# EAGLE design Impedance_7x7 (EAGLE 9.6.2)
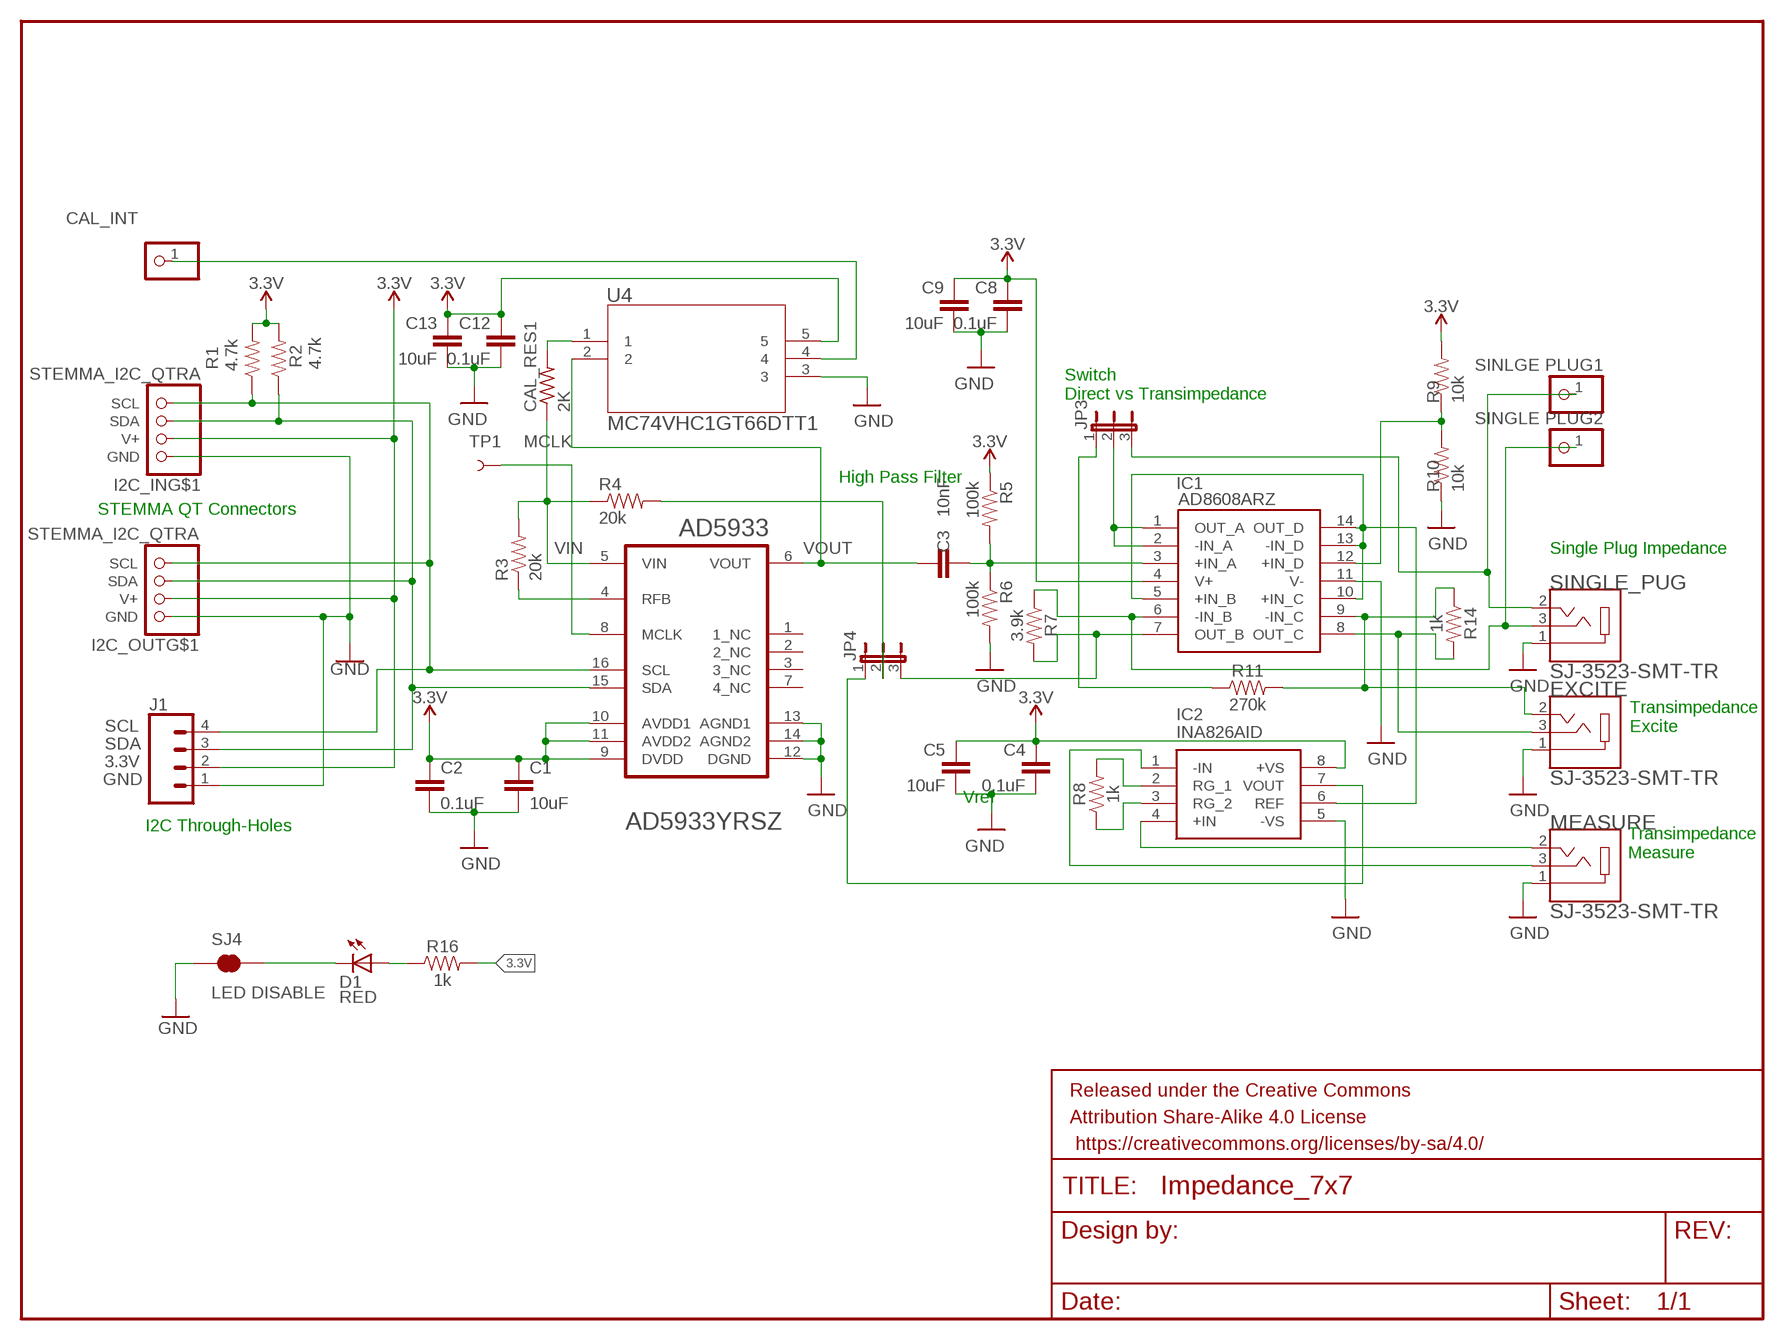
[diagram p0: schematic, sheet 1]

## Parts
AD5933  ANALOG_DEVICES_AD5933YRSZANALOG_DEVICES_AD5933YRSZ_0_0  [ANALOG_DEVICES_AD5933YRSZ_0]
C1  10uF  C-EUC0603  [C0603]
C2  0.1uF  C-EUC0603  [C0603]
C3  10nF  0.1UF-0603-25V-(+80/-20%)  [0603]
C4  0.1uF  C-EUC0603  [C0603]
C5  10uF  C-EUC0603  [C0603]
C8  0.1uF  C-EUC0603  [C0603]
C9  10uF  C-EUC0603  [C0603]
C12  0.1uF  C-EUC0603  [C0603]
C13  10uF  C-EUC0603  [C0603]
CAL_INT  PINHD-1X1  [1X01]
CAL_RES1  2K  R-US_R0603  [R0603]
D1  RED  LED-RED0603  [LED-0603]
EXCITE  SJ-3523-SMT-TR  [CUI_SJ-3523-SMT-TR]
FRAME1  FRAME-LETTERNO_PACKAGE  [DUMMY]
I2C_IN  STEMMA_I2C_QTRA  [JST_SH4_RA]
I2C_OUT  STEMMA_I2C_QTRA  [JST_SH4_RA]
IC1  AD8608ARZ  [SOIC127P600X175-14N]
IC2  INA826AID  [SOIC127P600X175-8N]
J1  CONN_04  [1X04]
JP3  JP2E  [JP2]
JP4  JP2E  [JP2]
MEASURE  SJ-3523-SMT-TR  [CUI_SJ-3523-SMT-TR]
R1  4.7k  4.7KOHM-0603-1/10W-1%  [0603]
R2  4.7k  4.7KOHM-0603-1/10W-1%  [0603]
R3  20k  20KOHM-0603-1/10W-1%  [0603]
R4  20k  20KOHM-0603-1/10W-1%  [0603]
R5  100k  47KOHM-0603-1/10W-1%  [0603]
R6  100k  47KOHM-0603-1/10W-1%  [0603]
R7  3.9k  3.9KOHM-0603-1/10W-1%  [0603]
R8  1k  5.6KOHM-0603-1/10W-1%  [0603]
R9  10k  47KOHM-0603-1/10W-1%  [0603]
R10  10k  47KOHM-0603-1/10W-1%  [0603]
R11  270k  1KOHM-0603-1/10W-1%  [0603]
R14  1k  1KOHM-0603-1/10W-1%  [0603]
R16  1k  1KOHM-0603-1/10W-1%  [0603]
SINGLE_PLUG1  SINLGE PLUG1  PINHD-1X1  [1X01]
SINGLE_PLUG2  SINGLE PLUG2  PINHD-1X1  [1X01]
SINGLE_PUG  SJ-3523-SMT-TR  [CUI_SJ-3523-SMT-TR]
SJ4  LED DISABLE  JUMPER-SMT_2_NC_TRACE_NO-SILK  [SMT-JUMPER_2_NC_TRACE_NO-SILK]
TP1  TEST-POINT3X5  [PAD.03X.05]
U4  MC74VHC1GT66DTT1  [TSOP5_1P65X3P15_ONS]

## Nets
3.3V: AD5933.9(DVDD) AD5933.10(AVDD1) AD5933.11(AVDD2) C1.1 C2.1 C4.1 C5.1 C8.1 C9.1 C12.1 C13.1 I2C_IN.2(V+) I2C_OUT.2(V+) IC1.4(V+) IC2.8(+VS) J1.2 R1.2 R2.2 R5.1 R9.2 R16.2 U4.5
GND: AD5933.12(DGND) AD5933.13(AGND1) AD5933.14(AGND2) C1.2 C2.2 C4.2 C5.2 C8.2 C9.2 C12.2 C13.2 EXCITE.1 I2C_IN.1(GND) I2C_OUT.1(GND) IC1.11(V-) IC2.5(-VS) J1.1 MEASURE.1 R6.2 R10.1 SINGLE_PUG.1 SJ4.1 U4.3
MCLK: AD5933.8(MCLK) TP1.P$1
N$1: IC1.6(-IN_B) R7.1 SINGLE_PLUG2.1 SINGLE_PUG.3
N$2: CAL_INT.1 U4.4
N$3: IC1.7(OUT_B) JP4.3 R7.2
N$4: JP4.2 R4.2
N$5: AD5933.4(RFB) R3.1
N$6: C3.2 IC1.3(+IN_A) R5.2 R6.1
N$7: JP3.3 SINGLE_PLUG1.1 SINGLE_PUG.2
N$8: JP3.1 R11.1
N$9: IC1.1(OUT_A) IC1.2(-IN_A) JP3.2
N$13: IC2.7(VOUT) JP4.1
N$14: IC1.12(+IN_D) R9.1 R10.2
N$18: IC1.5(+IN_B) IC1.10(+IN_C) IC1.13(-IN_D) IC1.14(OUT_D) IC2.6(REF)
N$19: EXCITE.2 IC1.9(-IN_C) R11.2 R14.1
N$20: IC2.4(+IN) MEASURE.2
N$21: IC2.1(-IN) MEASURE.3
N$22: IC2.2(RG_1) R8.2
N$23: IC2.3(RG_2) R8.1
N$24: CAL_RES1.2 U4.1
N$25: EXCITE.3 IC1.8(OUT_C) R14.2
N$26: D1.A R16.1
N$28: D1.C SJ4.2
SCL: AD5933.16(SCL) I2C_IN.4(SCL) I2C_OUT.4(SCL) J1.4 R1.1
SDA: AD5933.15(SDA) I2C_IN.3(SDA) I2C_OUT.3(SDA) J1.3 R2.1
VIN: AD5933.5(VIN) CAL_RES1.1 R3.2 R4.1
VOUT: AD5933.6(VOUT) C3.1 U4.2
Unconnected: AD5933.1(1_NC) AD5933.2(2_NC) AD5933.3(3_NC) AD5933.7(4_NC) I2C_IN.MT1(MT) I2C_IN.MT2(MT) I2C_OUT.MT1(MT) I2C_OUT.MT2(MT)

## Notes on the sheet
- Switch 
  Direct vs Transimpedance
- High Pass Filter
- STEMMA QT Connectors
- Single Plug Impedance
- Transimpedance
  Excite
- Vref
- I2C Through-Holes
- Transimpedance
  Measure

## Library data of the parts
AD5933 = Analog Devices - AD5933YRSZ:ANALOG_DEVICES_AD5933YRSZ: ADI-AD5933-RS-16; CIIVA_IDS: 19299999; CODE__JEDEC: MO-150-AC; COMPONENT_LINK_1_DESCRIPTION: Manufacturer URL; COMPONENT_LINK_1_URL: www.analog.com; COMPONENT_LINK_3_DESCRIPTION: Package Specification; COMPONENT_LINK_3_URL: http://www.analog.com/static/imported-files/packages/31572257652246RS_16.pdf; DATASHEET: http://www.analog.com/static/imported-files/data_sheets/AD5933.pdf; DATASHEET_VERSION: Rev. D; FOOTPRINT_VARIANT_NAME_0: Level C; FOOTPRINT_VARIANT_NAME_1: Level B; FOOTPRINT_VARIANT_NAME_2: Level A; IMPORTED: yes; IMPORTED_FROM: vault; IMPORT_TS: 1521848033; IO_INTERFACE: Serial; I_SUPPLY_TOTAL_MAX: 15mA; MASTER_FCLK: 16.776MHz; MF: Analog Devices; MPN: AD5933YRSZ; PACKAGE: RS-16; PACKAGE_DESCRIPTION: 16-Lead Shrink Small Outline Package [SSOP]; PACKAGE_VERSION: 3/17/2005; PIN_0_0_15_INSIDE_EDGE: clock; PIN_0_0_7_INSIDE_EDGE: clock; PREFIX: U; RELEASE_DATE: 1333437714; RESOLUTION_BITS: 12bit; TUNING_WORD_WIDTH_BITS: 27bit; VAULT_GUID: 12E548FF-7E75-4596-9B3A-06B167E4919E; VAULT_REVISION: 0B288880-7FBC-46A2-8187-17CED40A7223
C1 C2 C4 C5 C8 C9 C12 C13 = rcl:C-EU: CAPACITOR, European symbol; SPICEPREFIX: C
C3 = SparkFun-Capacitors:0.1UF: 0.1µF ceramic capacitors A capacitor is a passive two-terminal electrical component used to store electrical energy temporarily in an electric field.; PROD_ID: CAP-00810; VALUE: 0.1uF
CAL_INT SINGLE_PLUG1 SINGLE_PLUG2 = pinhead:PINHD-1X1: PIN HEADER
CAL_RES1 = rcl:R-US_: RESISTOR, American symbol; SPICEPREFIX: R
D1 = SparkFun-LED:LED-RED: Assorted Red LEDs LilyPad 1206- DIO-09912 1206- DIO-00809 0603- DIO-00819; PROD_ID: DIO-00819
EXCITE MEASURE SINGLE_PUG = SJ-3523-SMT-TR:SJ-3523-SMT-TR: Audio Jack Connector 3.5 mm Low Profile Surface Mount Stereo Jack, 3 Pin Right-Angle Check availability <https://pricing.snapeda.com/parts/SJ-3523-SMT-TR/CUI%20Devices/view-part?ref=eda>; AVAILABILITY: In Stock; CUI_PURCHASE_URL: https://www.cuidevices.com/product/interconnect/connectors/audio-connectors/jacks/sj-352x-smt-series?utm_source=snapeda.com&utm_medium=referral&utm_campaign=snapedaBOM; DESCRIPTION: 3.5 mm, Stereo, Right Angle, Surface Mount (SMT), 3 Conductors, 0~1 Internal Switches, Audio Jack Connector; MF: CUI Devices; MP: SJ-3523-SMT-TR; PACKAGE: None; PRICE: None; PURCHASE-URL: https://pricing.snapeda.com/search/part/SJ-3523-SMT-TR/?ref=eda
FRAME1 = SparkFun-Aesthetics:FRAME-LETTER: Schematic Frame - Letter Standard 8.5x11 US Letter frame; DESIGNER: Nobody; VERSION: v01
I2C_IN I2C_OUT = adafruit_electromech:STEMMA_I2C; LCSC: C145961
IC1 = AD8608ARZ:AD8608ARZ: Precision Amplifiers Low Noise CMOS RRIO Prec Quad Source: Datasheet <https://componentsearchengine.com/Datasheets/1/AD8608ARZ.pdf>; DESCRIPTION: Precision Amplifiers Low Noise CMOS RRIO Prec Quad; HEIGHT: 1.75mm; MANUFACTURER_NAME: Analog Devices; MANUFACTURER_PART_NUMBER: AD8608ARZ; MOUSER_PART_NUMBER: 584-AD8608ARZ; MOUSER_PRICE-STOCK: https://www.mouser.co.uk/ProductDetail/Analog-Devices/AD8608ARZ?qs=%2FtpEQrCGXCxN7b5tuN73yg%3D%3D
IC2 = INA826AID:INA826AID: Texas Instruments INA826AID Instrumentation Amplifier, 150uV Offset 1MHz GBW, CMMR 80dB, 2.7 36 V, 8-Pin SOIC Source: Datasheet <http://www.ti.com/lit/gpn/ina826>; DESCRIPTION: Texas Instruments INA826AID Instrumentation Amplifier, 150uV Offset 1MHz GBW, CMMR 80dB, 2.7 36 V, 8-Pin SOIC; HEIGHT: 1.75mm; MANUFACTURER_NAME: Texas Instruments; MANUFACTURER_PART_NUMBER: INA826AID; MOUSER_PART_NUMBER: 595-INA826AID; MOUSER_PRICE-STOCK: https://www.mouser.co.uk/ProductDetail/Texas-Instruments/INA826AID?qs=RqytGdBYyUH0CDtkCzl1iw%3D%3D
J1 = SparkFun-Connectors:CONN_04: Multi connection point. Often used as Generic Header-pin footprint for 0.1 inch spaced/style header connections On any of the 0.1 inch spaced packages, you can populate with these: Break Away Headers - Straight <https://www.sparkfun.com/products/116> (PRT-00116) Break Away Male Headers - Right Angle <https://www.sparkfun.com/products/553> (PRT-00553) Female Headers <https://www.sparkfun.com/products/115> (PRT-00115) Break Away Headers - Machine Pin <https://www.sparkfun.com/products/117> (PRT-00117) Break Away Female Headers - Swiss Machine Pin <https://www.sparkfun.com/products/743> (PRT-00743) For SCREWTERMINALS and SPRING TERMINALS visit here: Screw Terimnals on SparkFun.com <https://www.sparkfun.com/search/results?term=Screw+Terminals> (5mm/3.5mm/2.54mm spacing) This device is also useful as a general connection point to wire up your design to another part of your project. Our various solder wires solder well into these plated through hole pads. Hook-Up Wire - Assortment (Stranded, 22 AWG) <https://www.sparkfun.com/products/11375> (PRT-11375) Hook-Up Wire - Assortment (Solid Core, 22 AWG) <https://www.sparkfun.com/products/11367> (PRT-11367) View the entire wire category on our website here <https://www.sparkfun.com/categories/141> Special notes: Molex polarized connector foot print use with SKU : PRT-08231 with associated crimp pins and housings. 1MM SMD Version SKU: PRT-10208; PROD_ID: CONN-09696
JP3 JP4 = jumper:JP2E: JUMPER
R1 R2 = SparkFun-Resistors:4.7KOHM: 4.7kΩ resistor A resistor is a passive two-terminal electrical component that implements electrical resistance as a circuit element. Resistors act to reduce current flow, and, at the same time, act to lower voltage levels within circuits. - Wikipedia; PROD_ID: RES-07857
R3 R4 = SparkFun-Resistors:20KOHM: 20kΩ resistor A resistor is a passive two-terminal electrical component that implements electrical resistance as a circuit element. Resistors act to reduce current flow, and, at the same time, act to lower voltage levels within circuits. - Wikipedia; PROD_ID: RES-09383
R5 R6 R9 R10 = SparkFun-Resistors:47KOHM: 47kΩ resistor A resistor is a passive two-terminal electrical component that implements electrical resistance as a circuit element. Resistors act to reduce current flow, and, at the same time, act to lower voltage levels within circuits. - Wikipedia; PROD_ID: RES-07871; VALUE: 47k
R7 = SparkFun-Resistors:3.9KOHM: 3.9kΩ resistor A resistor is a passive two-terminal electrical component that implements electrical resistance as a circuit element. Resistors act to reduce current flow, and, at the same time, act to lower voltage levels within circuits. - Wikipedia; PROD_ID: RES-08701
R8 = SparkFun-Resistors:5.6KOHM: 5.6kΩ resistor A resistor is a passive two-terminal electrical component that implements electrical resistance as a circuit element. Resistors act to reduce current flow, and, at the same time, act to lower voltage levels within circuits. - Wikipedia; PROD_ID: RES-12378; VALUE: 5.6k
R11 = SparkFun-Resistors:1KOHM: 1kΩ resistor A resistor is a passive two-terminal electrical component that implements electrical resistance as a circuit element. Resistors act to reduce current flow, and, at the same time, act to lower voltage levels within circuits. - Wikipedia; PROD_ID: RES-07856; VALUE: 1k
R14 R16 = SparkFun-Resistors:1KOHM: 1kΩ resistor A resistor is a passive two-terminal electrical component that implements electrical resistance as a circuit element. Resistors act to reduce current flow, and, at the same time, act to lower voltage levels within circuits. - Wikipedia; PROD_ID: RES-07856
SJ4 = SparkFun-Jumpers:JUMPER-SMT_2_NC_TRACE: Normally closed trace jumper This jumper has a trace between two pads so it's normally closed (NC). Use a razor knife to open the connection. For best results follow the IPC guidelines for cutting traces: Cutout at least 0.063 mm (0.005 in). Remove all loose material to clean up the cut area. Seal the cut with an approved epoxy. Reapply solder to reclose the connection.
TP1 = SparkFun-Connectors:TEST-POINT: SparkFun Test Points Bare copper test points for troubleshooting or In-Circuit-Testing. These are used by our Production team for verifying production board runs using pogo-pins on test beds. SparkFun Products: SparkFun LSM9DS1 Breakout <https://www.sparkfun.com/products/13284> SparkFun PSOC <https://www.sparkfun.com/products/13714> SparkFun Load Cell Amplifier <https://www.sparkfun.com/products/13879>
U4 = MC74VHC1GT66DTT1:MC74VHC1GT66DTT1; COPYRIGHT: Copyright (C) 2024 Ultra Librarian. All rights reserved.; MANUFACTURER_PART_NUMBER: MC74VHC1GT66DTT1; MFR_NAME: onsemi

## Board
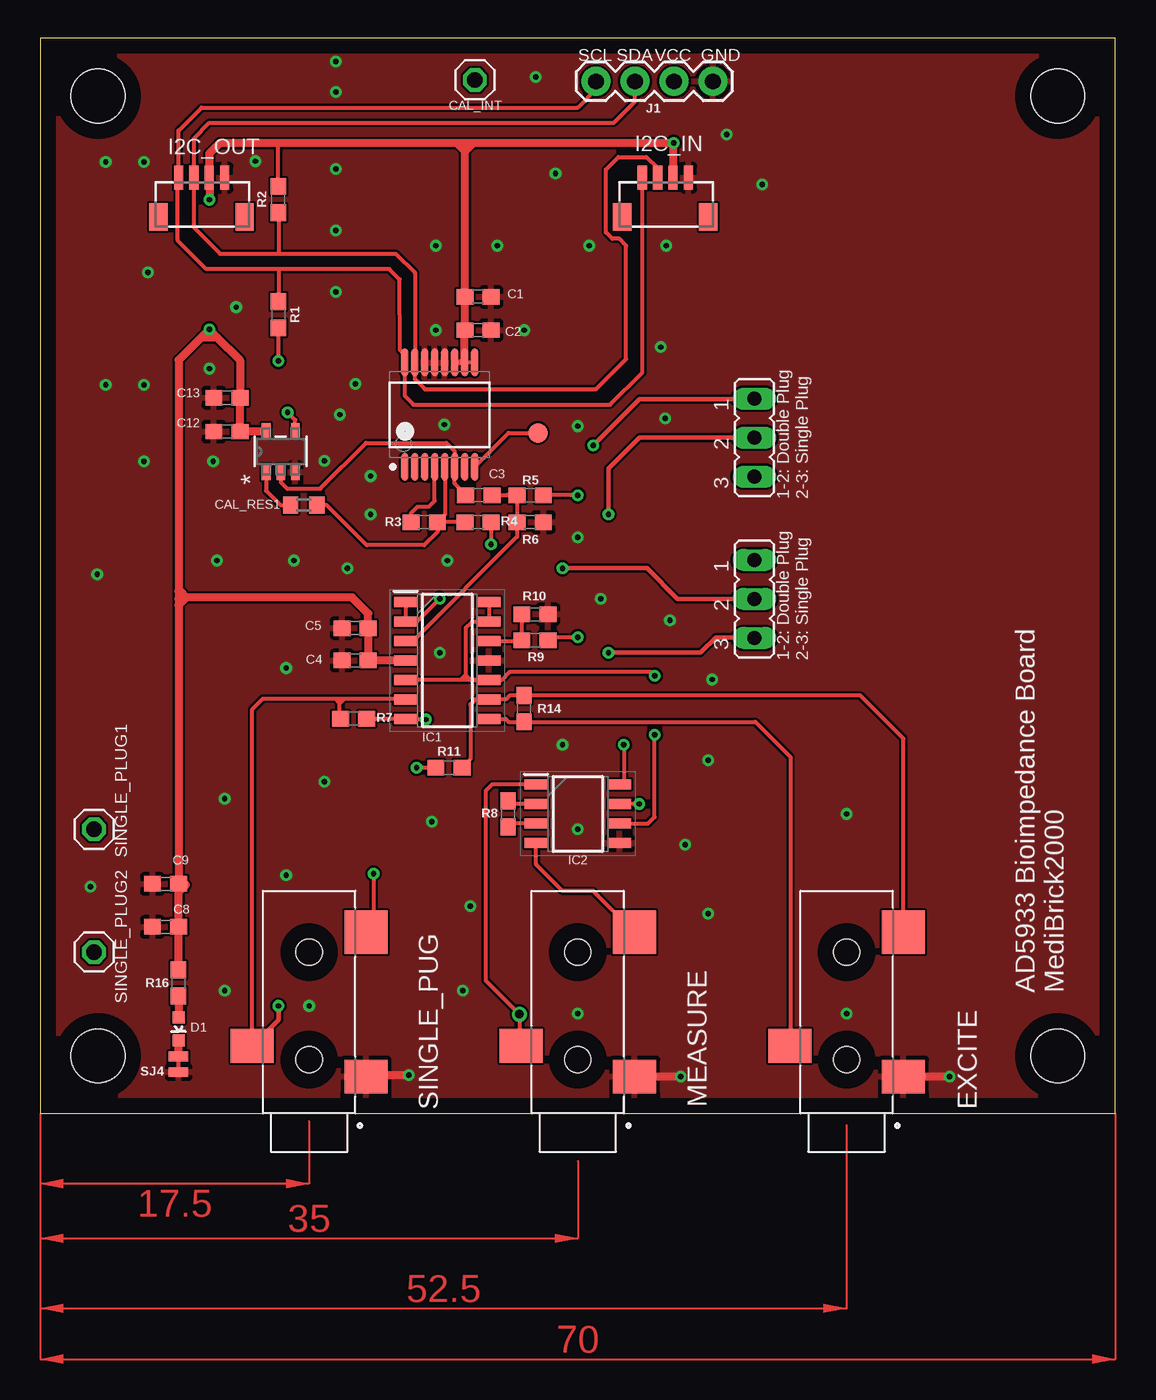
[diagram p1: board, top side]
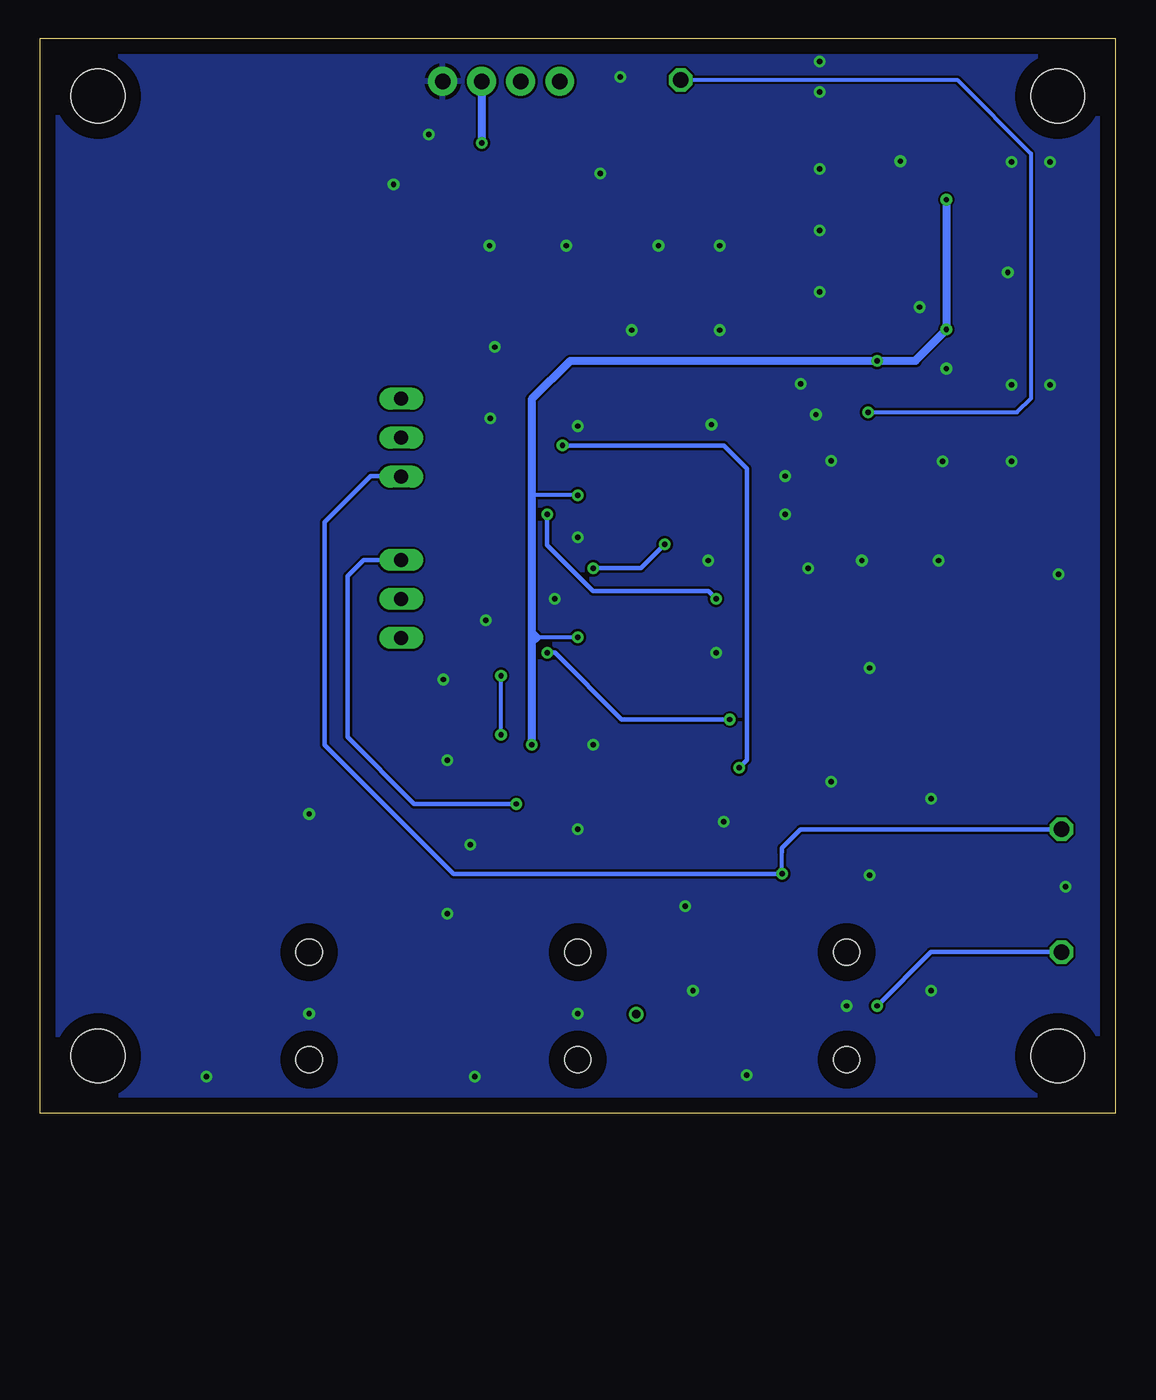
[diagram p2: board, bottom side, seen from below]

Size 70 x 70 mm. Coordinates in mm from the lower left corner, seen from the top.
Outline: 0,0 70,0 70,70 0,70 0,0
Copper layers (1*16): Top 0.035mm / dielectric 1.5mm / Bottom 0.035mm
Design rules "default": minimum track width 6mil, minimum drill 0.35mm, track to track 6mil, track to pad 6mil, pad to pad 6mil, via to via 6mil, smd to smd 6mil, copper to edge 40mil, drill to drill 6mil, minimum pad ring 10mil, minimum via ring 8mil, stop-mask expansion 4mil, vias tented up to drill 0mil, thermal gap 10mil
Holes 3.5 mm at 3.75,66.25 66.25,66.25 3.75,3.75 66.25,3.75

### Footprints (pad centres in the part's own frame; a part is rotated, then mirrored left to right if it is on the bottom)
ANALOG_DEVICES_AD5933YRSZ_0 = smd 1.8 x 0.45: 1 -3.4,2.275; 2 -3.4,1.625; 3 -3.4,0.975; 4 -3.4,0.325; 5 -3.4,-0.325; 6 -3.4,-0.975; 7 -3.4,-1.625; 8 -3.4,-2.275; 9 3.4,-2.275; 10 3.4,-1.625; 11 3.4,-0.975; 12 3.4,-0.325; 13 3.4,0.325; 14 3.4,0.975; 15 3.4,1.625; 16 3.4,2.275
C0603 = smd 1.1 x 1: 1 -0.85,0; 2 0.85,0
0603 = smd 1.1 x 1: 1 -0.85,0; 2 0.85,0
1X01 = drill 1.016 octagon: 1 0,0
R0603 = smd 1 x 1.1: 1 -0.85,0; 2 0.85,0
LED-0603 = smd 0.8 x 0.8: A 0,-0.75; C 0,0.75
CUI_SJ-3523-SMT-TR = smd 2.2 x 2.8: 1 -1.1,-3.7; 3 0.9,3.7 | smd 2.8 x 2.8: 2 8.3,-3.7 | hole 1.7: 0,0; 7,0
JST_SH4_RA = smd 0.6 x 1.55: 1 1.5,0.924; 2 0.5,0.924; 3 -0.5,0.924; 4 -1.5,0.924 | smd 1.2 x 1.8: MT1 -2.8,-1.624; MT2 2.8,-1.624
SOIC127P600X175-14N = smd 1.525 x 0.65: 1 -2.712,3.81; 2 -2.712,2.54; 3 -2.712,1.27; 4 -2.712,0; 5 -2.712,-1.27; 6 -2.712,-2.54; 7 -2.712,-3.81; 8 2.712,-3.81; 9 2.712,-2.54; 10 2.712,-1.27; 11 2.712,0; 12 2.712,1.27; 13 2.712,2.54; 14 2.712,3.81
SOIC127P600X175-8N = smd 1.525 x 0.65: 1 -2.712,1.905; 2 -2.712,0.635; 3 -2.712,-0.635; 4 -2.712,-1.905; 5 2.712,-1.905; 6 2.712,-0.635; 7 2.712,0.635; 8 2.712,1.905
1X04 = drill 1.016 pad 1.88: 1 0,0; 2 2.54,0; 3 5.08,0; 4 7.62,0
JP2 = drill 0.914 long: 1 -2.54,0; 2 0,0; 3 2.54,0
SMT-JUMPER_2_NC_TRACE_NO-SILK = smd 0.635 x 1.27: 1 -0.508,0; 2 0.508,0
PAD.03X.05 = smd 1.27 x 1.27: P$1 0,0
TSOP5_1P65X3P15_ONS = smd 1.029 x 0.559: 1 -1.34,0.95; 2 -1.34,0; 3 -1.34,-0.95; 4 1.34,-0.95; 5 1.34,0.95

### Placement (x,y rotation side)
AD5933  26,45.5 90 top
C1  28.5,53.17 0 top
C2  28.5,51 0 top
C3  28.55,40.25 0 top
C4  20.5,29.5 180 top
C5  20.5,31.6 180 top
C8  8.15,12.15 180 top
C9  8.15,14.95 180 top
C12  12.15,44.4 180 top
C13  12.15,46.6 180 top
CAL_INT  28.3,67.3 0 top
CAL_RES1  17.15,39.6 180 top
D1  9,5.5 180 top
EXCITE  52.5,3.5 90 top
FRAME1  -10.7,-36.8 0 top  (outside the outline)
I2C_IN  40.7,60 0 top
I2C_OUT  10.5,60 0 top
IC1  26.5,29.5 0 top
IC2  35,19.5 0 top
J1  43.8,67.2 180 top
JP3  46.5,44 270 top
JP4  46.5,33.5 270 top
MEASURE  35,3.5 90 top
R1  15.51,52 270 top
R2  15.49,59.51 90 top
R3  25,38.5 0 top
R4  28.5,38.5 0 top
R5  31.9,40.25 180 top
R6  31.9,38.5 0 top
R7  20.4,25.7 0 top
R8  30.45,19.5 90 top
R9  32.2,30.8 0 top
R10  32.2,32.5 180 top
R11  26.6,22.5 0 top
R14  31.5,26.35 270 top
R16  9,8.5 90 top
SINGLE_PLUG1  3.5,18.5 0 top
SINGLE_PLUG2  3.5,10.5 0 top
SINGLE_PUG  17.5,3.5 90 top
SJ4  9,3.2 90 top
TP1  32.4,44.3 0 top
U4  15.65,43.1 90 top

### Tracks (layer width: path | path; a pad name or v marks a point on that pad's centre or on a via)
3.3V  (via drill 0.35)
  Top 0.254: AD5933.9 AD5933.10 | R2.2 15.49,63.17 15.5,63.18 | v35,31 33.25,31 R9.2 | IC2.8 38.01,21.41 38.01,23.99 v38,24 | v35,40.25 R5.1 | v15.5,49 R1.2
  Top 0.406: AD5933.10 AD5933.11
  Top 0.508: v11,59.5 11.02,59.52 I2C_OUT.2 11,62.5 11.68,63.18 15.5,63.18 27.14,63.18 | IC1.4 C4.1 C5.1 21.35,32.55 20.3,33.6 9.5,33.6 | 27.65,62.67 C1.1 C2.1 27.62,50.98 AD5933.10 | 27.65,62.67 27.14,63.18 | 28.16,63.18 27.14,63.18 | 27.65,62.67 28.16,63.18 | U4.5 13.04,44.44 C12.1 C13.1 13,49.05 11.53,50.52 | 10.47,50.52 9,49.05 9,34 | R16.2 C8.1 9,14.41 9.47,14.88 C9.1 9,33.1 | 28.16,63.18 41.23,63.18 v41.25,63.2 41.2,63.15 I2C_IN.2 | 9,34 9,33.5 | 9,33.5 9,33.1 | 9,33.5 9.1,33.6 9.5,33.6 | 9,34 9.1,34 9.5,33.6 | 9.5,33.6 9,33.1 | 11.53,50.52 10.47,50.52 | 10.47,50.52 v11,51.05 11.53,50.52
  Bottom 0.254: v35,31 37.5,31 | 38,31 37.5,31 | 37.5,31 38,31.5 | 37.5,31 38,30.5 | v35,40.25 38,40.25
  Bottom 0.508: v11,59.5 v11,51.05 13,49.05 13,49 v15.5,49 35.5,49 38,46.5 38,40.25 38,31.5 38,31 38,30.5 v38,24 | v41.25,63.2 J1.2
GND  (via drill 0.35, 0.35 pad 0.55)
  Top 0.508: MEASURE.1 v41.7,2.4 | EXCITE.1 v59.2,2.4 59.3,2.4 | SINGLE_PUG.1 21.3,2.5 v24,2.5
  Bottom 0.508: v41.7,2.4 41.8,2.3
  other vias: 3.25,14.75 3.7,35.1 14,62 21.5,41.5 21.5,39 20.5,47.5 19.5,45.5 18.5,42.5 16.5,36 11.5,36 20,35.5 26.5,36 26.3,44.85 35,44.75 35,37.5 36.5,33.5 41,32.1 18.5,21.6 34,24 43.5,23 35,18.5 17.5,7 35,6.5 52.5,6.5 25.5,19 27.5,8 28,13.5 43.5,13 42,17.5 16,15.5 12,8 12,20.5 16,29 47,60.5 33.55,61.2 43.75,28.25 26,30 7,54.75 40.4,49.9 31.5,51 25.75,51 25.75,56.5 19.25,57.5 19.25,53.5 12.75,52.5 19.25,61.5 19.25,66.5 32.25,67.5 6.75,61.95 4.25,61.95 6.75,47.45 4.25,47.45 11.25,42.45 6.75,42.45 11,48.5 29.75,56.5 35.75,56.5 40.75,56.5 40.7,45.25 44.7,63.75 19.25,68.5 52.5,19.5
  pour Top: 0,70 0,0 70,0 70,70
  pour Bottom: 0,70 0,0 70,0 70,70
MCLK
  Top 0.254: AD5933.8 30.48,44.3 30.5,44.3 TP1.P$1
N$1  (via drill 0.35)
  Top 0.254: SINGLE_PUG.3 13.8,26.3 14.5,27 19.2,27 | 19.2,27 19.5,27 | 19.5,27 19.8,27 | 19.8,27 23.74,27 IC1.6 23.83,27 | R7.1 19.5,25.75 19.5,26.7 | 19.5,27 19.5,26.7 | 19.5,26.7 19.8,27 | 19.5,26.7 19.2,27
  Top 0.305: v15.5,7 15.5,6.1 SINGLE_PUG.3
  Bottom 0.305: SINGLE_PLUG2.1 12,10.5 v15.5,7
N$2  (via drill 0.35)
  Top 0.254: U4.4 16.6,45.15 v16.1,45.65
  Bottom 0.254: v16.1,45.65 6.4,45.65 5.5,46.55 5.5,62.5 10.3,67.3 CAL_INT.1
N$3  (via drill 0.35)
  Top 0.254: R7.2 IC1.7 23.83,25.65 v25.1,25.65
  Top 0.305: v37,30 43,30 44,31 46.46,31 JP4.3
  Bottom 0.305: v25.1,25.65 32.15,25.65 36.5,30 v37,30
N$4  (via drill 0.35)
  Top 0.254: R4.2 v29.35,37.05
  Top 0.305: v34,35.5 39.5,35.5 41.5,33.5 JP4.2
  Bottom 0.305: v29.35,37.05 30.9,35.5 v34,35.5
N$5
  Top 0.254: R3.1 24.15,39.1 24.55,39.5 25.3,39.5 25.68,39.88 AD5933.4
N$6
  Top 0.254: IC1.3 24.27,30.77 31.05,37.55 R6.1 31.05,40 | C3.2 30.35,40.25
  Top 0.305: 31.05,40 R5.2 30.35,40.25
N$7  (via drill 0.35)
  Top 0.254: v21.7,15.6 21.7,12.3 SINGLE_PUG.2
  Bottom 0.254: v21.7,15.6 21.7,17
  Bottom 0.305: SINGLE_PLUG1.1 20.5,18.5 21.7,17.3 21.7,17 | v21.7,15.6 43.1,15.6 51.5,24 51.5,38.5 48.5,41.5 46.54,41.5 JP3.3
N$8  (via drill 0.35)
  Top 0.254: R11.1 v24.5,22.5
  Top 0.305: v36,43.5 39,46.5 46.46,46.5 JP3.1
  Bottom 0.305: v24.5,22.5 24,23 24,42 25.5,43.5 v36,43.5
N$9  (via drill 0.35)
  Top 0.254: IC1.1 IC1.2 24.54,32.04 v26,33.5
  Top 0.305: v37,39 37,42 39,44 JP3.2
  Bottom 0.305: v26,33.5 26.5,34 34,34 37,37 v37,39
N$13  (via drill 0.35)
  Top 0.254: v39,20.15 37.73,20.15 IC2.7
  Bottom 0.305: v39,20.15 45.65,20.15 50,24.5 50,35 48.96,36.04 JP4.1
N$14
  Top 0.254: IC1.12 31.32,30.77 R9.1 R10.2
N$18  (via drill 0.35)
  Top 0.254: IC1.14 IC1.13 29.17,32 28.1,32 27.7,31.6 27.7,28.55 | 27.7,28.55 28.03,28.22 IC1.10 | IC1.10 27.37,28.22 | 27.37,28.22 IC1.5 | 27.7,28.55 27.37,28.22 | IC2.6 39.56,18.86 40,19.3 v40,24.65 | IC1.10 30.06,28.23 30.56,28.73 39.77,28.73 v40,28.5
  Bottom 0.254: v40,24.65 v40,28.5
N$19
  Top 0.254: R11.2 27.45,22.52 28.01,23.08 28.01,26.63 28.33,26.96 IC1.9 30.31,26.96 30.55,27.2 R14.1 53.4,27.2 56.2,24.4 EXCITE.2
N$20
  Top 0.254: MEASURE.2 36,14.5 34,14.5 32.29,16.21 IC2.4
N$21  (via drill 0.55)
  Top 0.254: 31.2,5.12 v31.2,6.45 29,8.65 29,21 29.41,21.41 IC2.1
  Top 0.406: 31.2,5.12 MEASURE.3
N$22
  Top 0.254: IC2.2 32.27,20.15 30.65,20.15 R8.2
N$23
  Top 0.254: R8.1 30.45,18.9 32.25,18.9 IC2.3
N$24
  Top 0.254: U4.1 14.7,40.55 15.65,39.6 CAL_RES1.2
N$25
  Top 0.254: IC1.8 30.31,25.69 30.5,25.5 R14.2 46.55,25.5 48.85,23.2 48.85,4.45 EXCITE.3
N$26
  Top 0.508: R16.1 D1.A
N$28
  Top 0.508: SJ4.2 D1.C
SCL
  Top 0.254: 15.5,54.98 22.72,54.98 23.4,54.3 23.42,49.7 23.73,49.4 AD5933.16 23.73,46.73 24.3,46.15 37.1,46.15 39.2,48.25 I2C_IN.4 | 15.5,54.98 10.8,54.98 8.95,56.84 8.95,60.89 I2C_OUT.4 9,64 10.5,65.5 35,65.5 36.18,66.68 J1.4 | R1.1 15.5,54.98
SDA
  Top 0.254: I2C_OUT.3 10.02,57.66 11.7,55.98 15.5,55.98 | I2C_OUT.3 | 15.5,55.98 23.14,55.98 24.4,54.74 24.4,48.92 AD5933.15 24.37,47.83 25.05,47.15 36.17,47.15 38.15,49.12 38.15,56.5 37.7,56.95 37.25,56.95 36.82,57.38 36.82,61.47 37.63,62.28 39.47,62.28 40.18,61.56 40.18,60.95 I2C_IN.3 | I2C_OUT.3 10,63.5 11,64.5 37.35,64.5 38.72,65.87 J1.3 | R2.1 15.5,55.98
VIN
  Top 0.254: R4.1 R3.2 | R3.2 26.35,39 26.35,42.08 AD5933.5 | R3.2 25.85,37.85 25,37 21.25,37 18.65,39.6 CAL_RES1.1
VOUT
  Top 0.254: C3.1 27.7,40.29 26.98,41.01 AD5933.6 26.98,43.12 26.45,43.65 21.2,43.65 18.23,40.68 16.07,40.68 15.65,41.1 U4.2
(copper drawn outside any net)
  shapes: Top area x4

### Text on the board
tNames: SCL | SDA | VCC | GND | 1-2: Double Plug / 2-3: Single Plug | 1-2: Double Plug / 2-3: Single Plug | AD5933 Bioimpedance Board / MediBrick2000